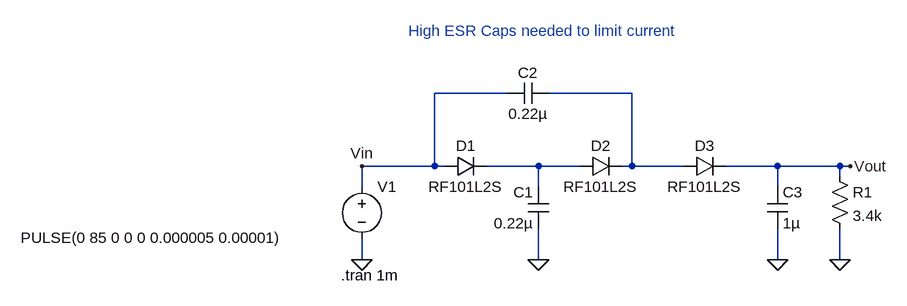
[diagram p0: schematic ChargePumpDoubler.asc]
ChargePumpDoubler.asc, the LTspice schematic file:
Version 4
SHEET 1 888 680
WIRE 288 -32 176 -32
WIRE 480 -32 352 -32
WIRE 176 80 176 -32
WIRE 176 80 64 80
WIRE 192 80 176 80
WIRE 336 80 256 80
WIRE 400 80 336 80
WIRE 480 80 480 -32
WIRE 480 80 464 80
WIRE 560 80 480 80
WIRE 704 80 624 80
WIRE 800 80 704 80
WIRE 816 80 800 80
WIRE 800 96 800 80
WIRE 64 112 64 80
WIRE 336 112 336 80
WIRE 704 112 704 80
WIRE 64 224 64 192
WIRE 336 224 336 176
WIRE 704 224 704 176
WIRE 800 224 800 176
FLAG 64 224 0
FLAG 336 224 0
FLAG 816 80 Vout
FLAG 64 80 Vin
FLAG 704 224 0
FLAG 800 224 0
SYMBOL voltage 64 96 R0
WINDOW 3 -525 94 Left 2
WINDOW 123 0 0 Left 0
WINDOW 39 0 0 Left 0
SYMATTR Value PULSE(0 85 0 0 0 0.000005 0.00001)
SYMATTR InstName V1
SYMBOL cap 352 176 R180
WINDOW 0 24 56 Left 2
WINDOW 3 24 8 Left 2
SYMATTR InstName C1
SYMATTR Value 0.22µ
SYMATTR SpiceLine Rser=10
SYMBOL diode 192 96 R270
WINDOW 0 32 32 VTop 2
WINDOW 3 0 32 VBottom 2
SYMATTR InstName D1
SYMATTR Value RF101L2S
SYMBOL diode 400 96 R270
WINDOW 0 32 32 VTop 2
WINDOW 3 0 32 VBottom 2
SYMATTR InstName D2
SYMATTR Value RF101L2S
SYMBOL cap 288 -16 R270
WINDOW 0 32 32 VTop 2
WINDOW 3 0 32 VBottom 2
SYMATTR InstName C2
SYMATTR Value 0.22µ
SYMATTR SpiceLine V=250 Rser=10
SYMBOL diode 560 96 R270
WINDOW 0 32 32 VTop 2
WINDOW 3 0 32 VBottom 2
SYMATTR InstName D3
SYMATTR Value RF101L2S
SYMBOL cap 688 112 R0
SYMATTR InstName C3
SYMATTR Value 1µ
SYMATTR SpiceLine Rser=1
SYMBOL res 784 80 R0
SYMATTR InstName R1
SYMATTR Value 3.4k
TEXT 32 248 Left 2 !.tran 1m
TEXT 136 -128 Left 2 ;High ESR Caps needed to limit current

The netlist it stands for:
* ChargePumpDoubler.asc
V1 Vin 0 PULSE(0 85 0 0 0 0.000005 0.00001)
C1 0 N002 0.22µ Rser=10
D1 Vin N002 RF101L2S
D2 N002 N001 RF101L2S
C2 Vin N001 0.22µ V=250 Rser=10
D3 N001 Vout RF101L2S
C3 Vout 0 1µ Rser=1
R1 Vout 0 3.4k
.model D D
.lib standard.dio
.tran 1m
* High ESR Caps needed to limit current
.backanno
.end